# EAGLE board Hutschienenmoped-XL_2ETH (EAGLE 9.6.2)
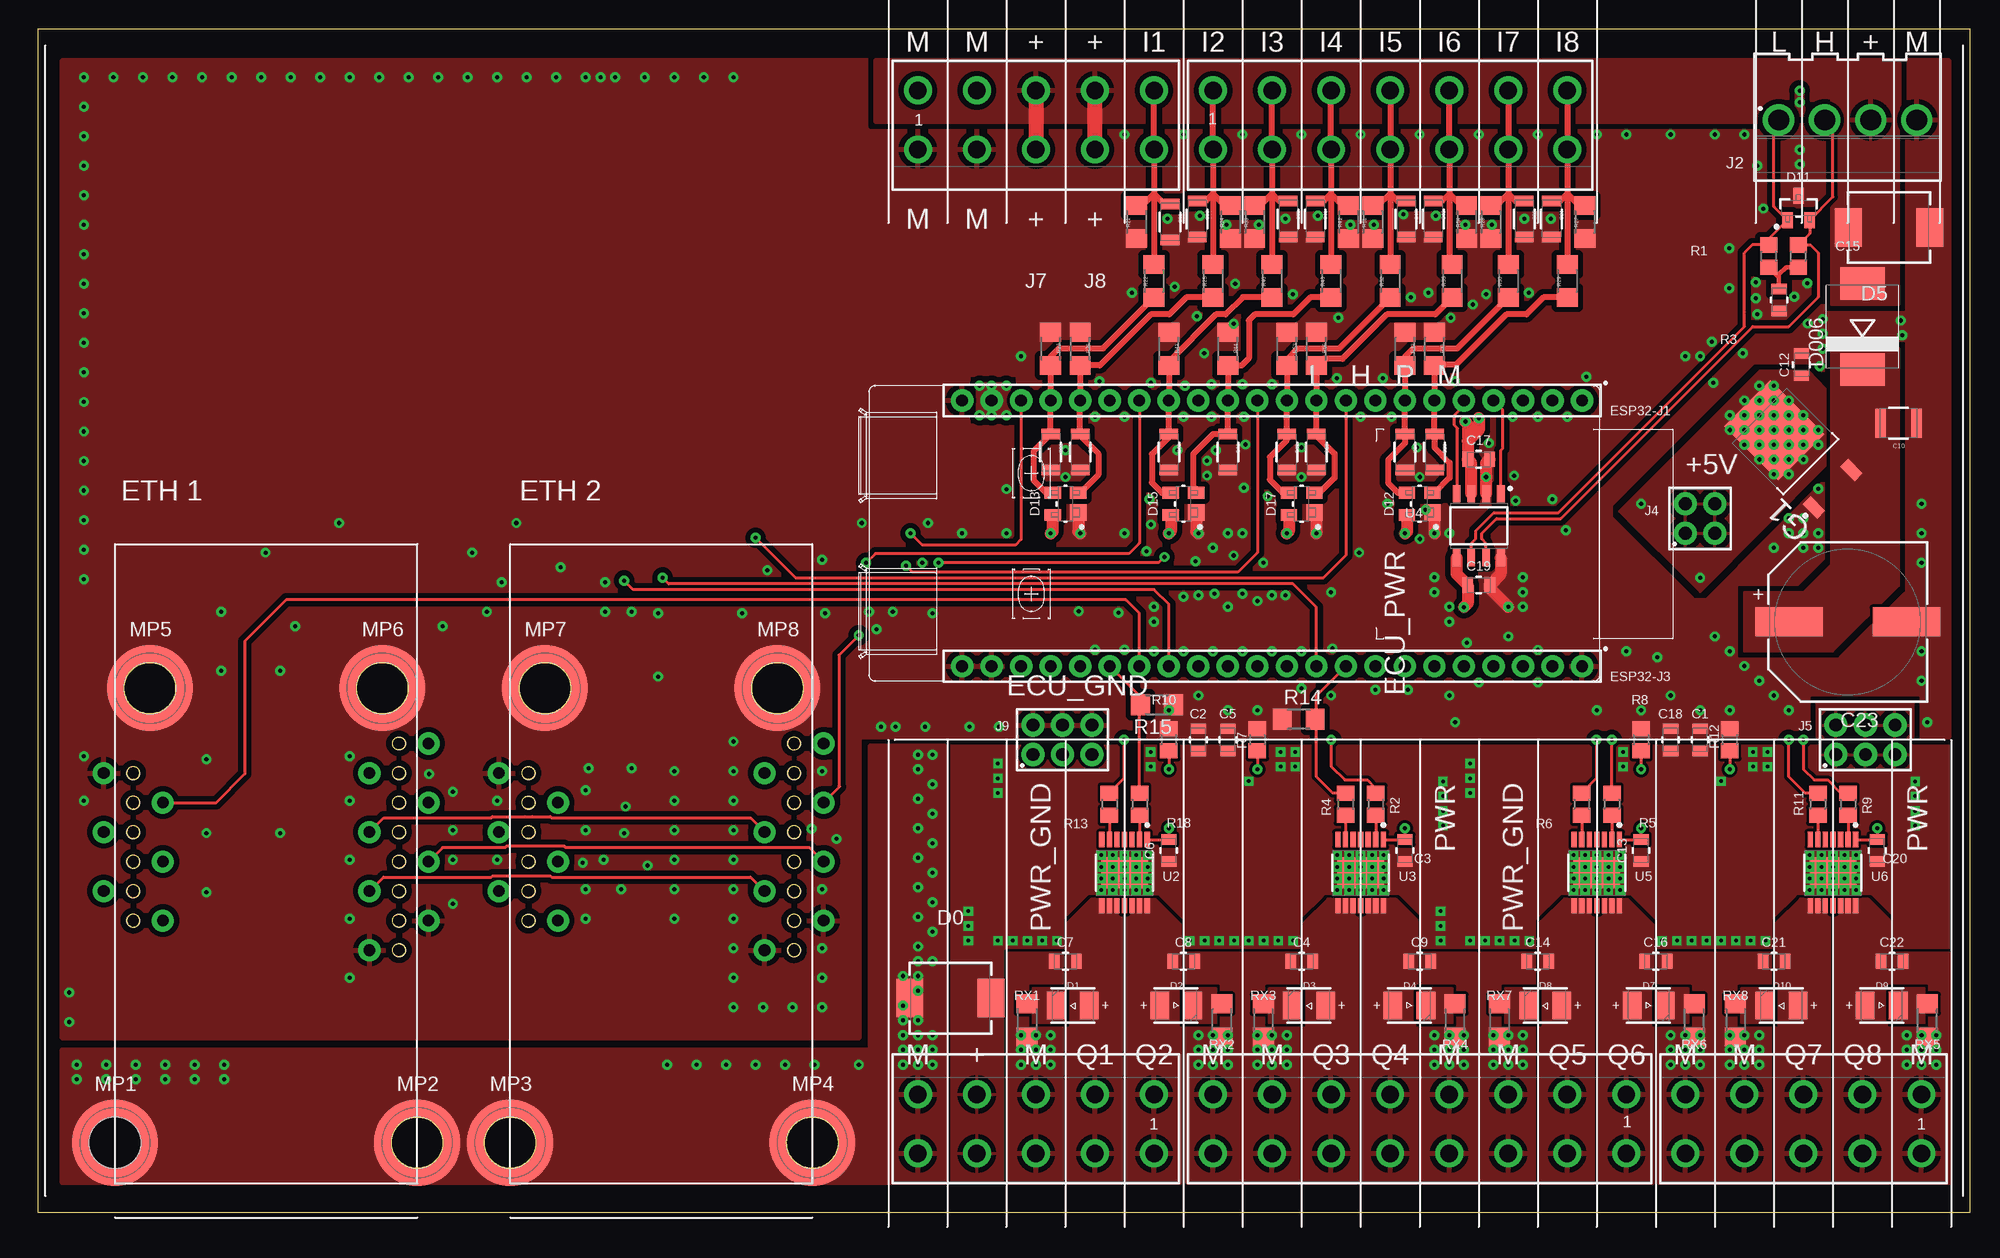
[diagram p13: board, top side]
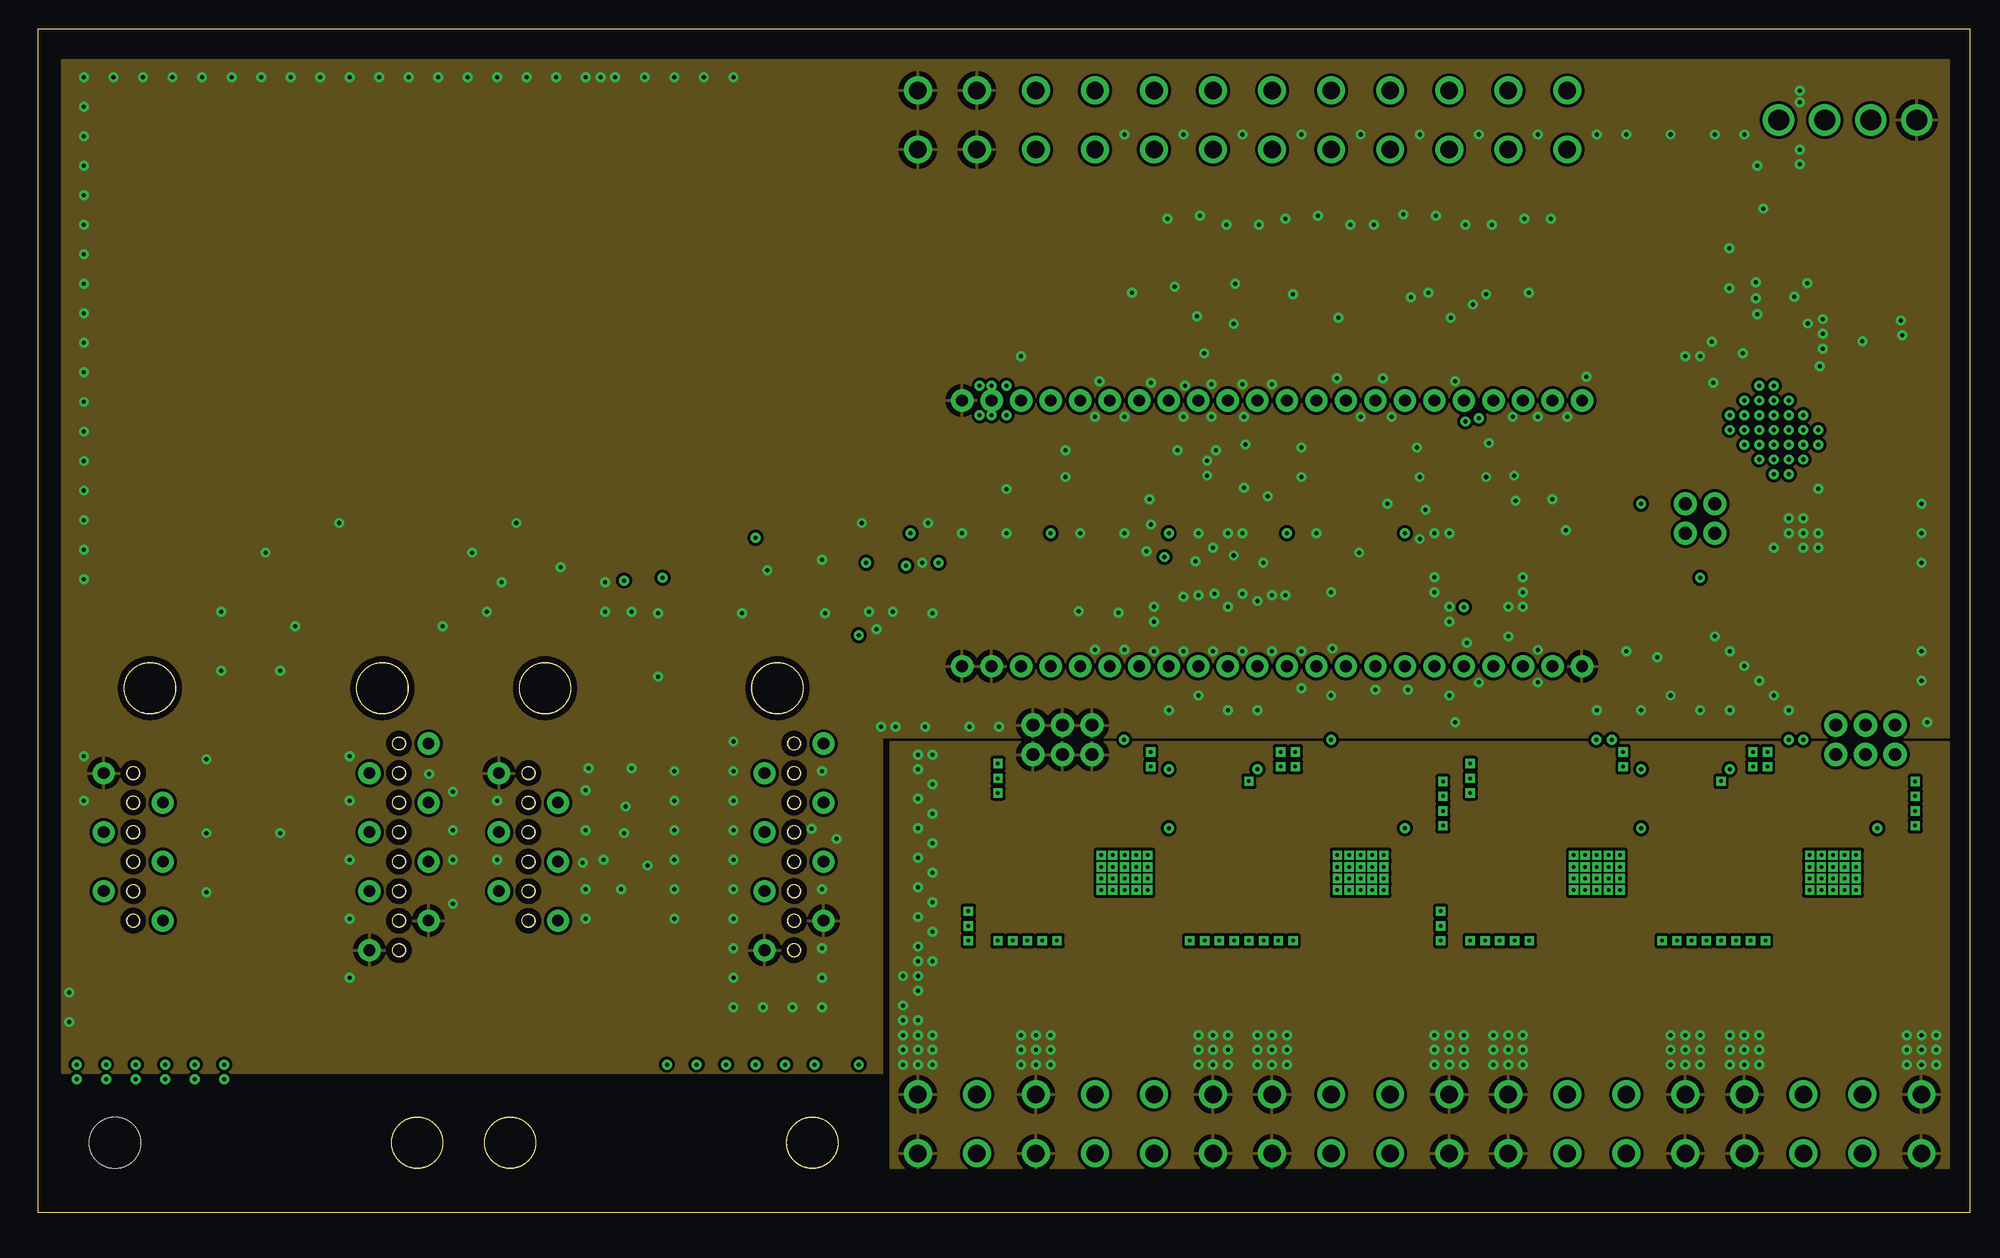
[diagram p14: board, inner layer Route2]
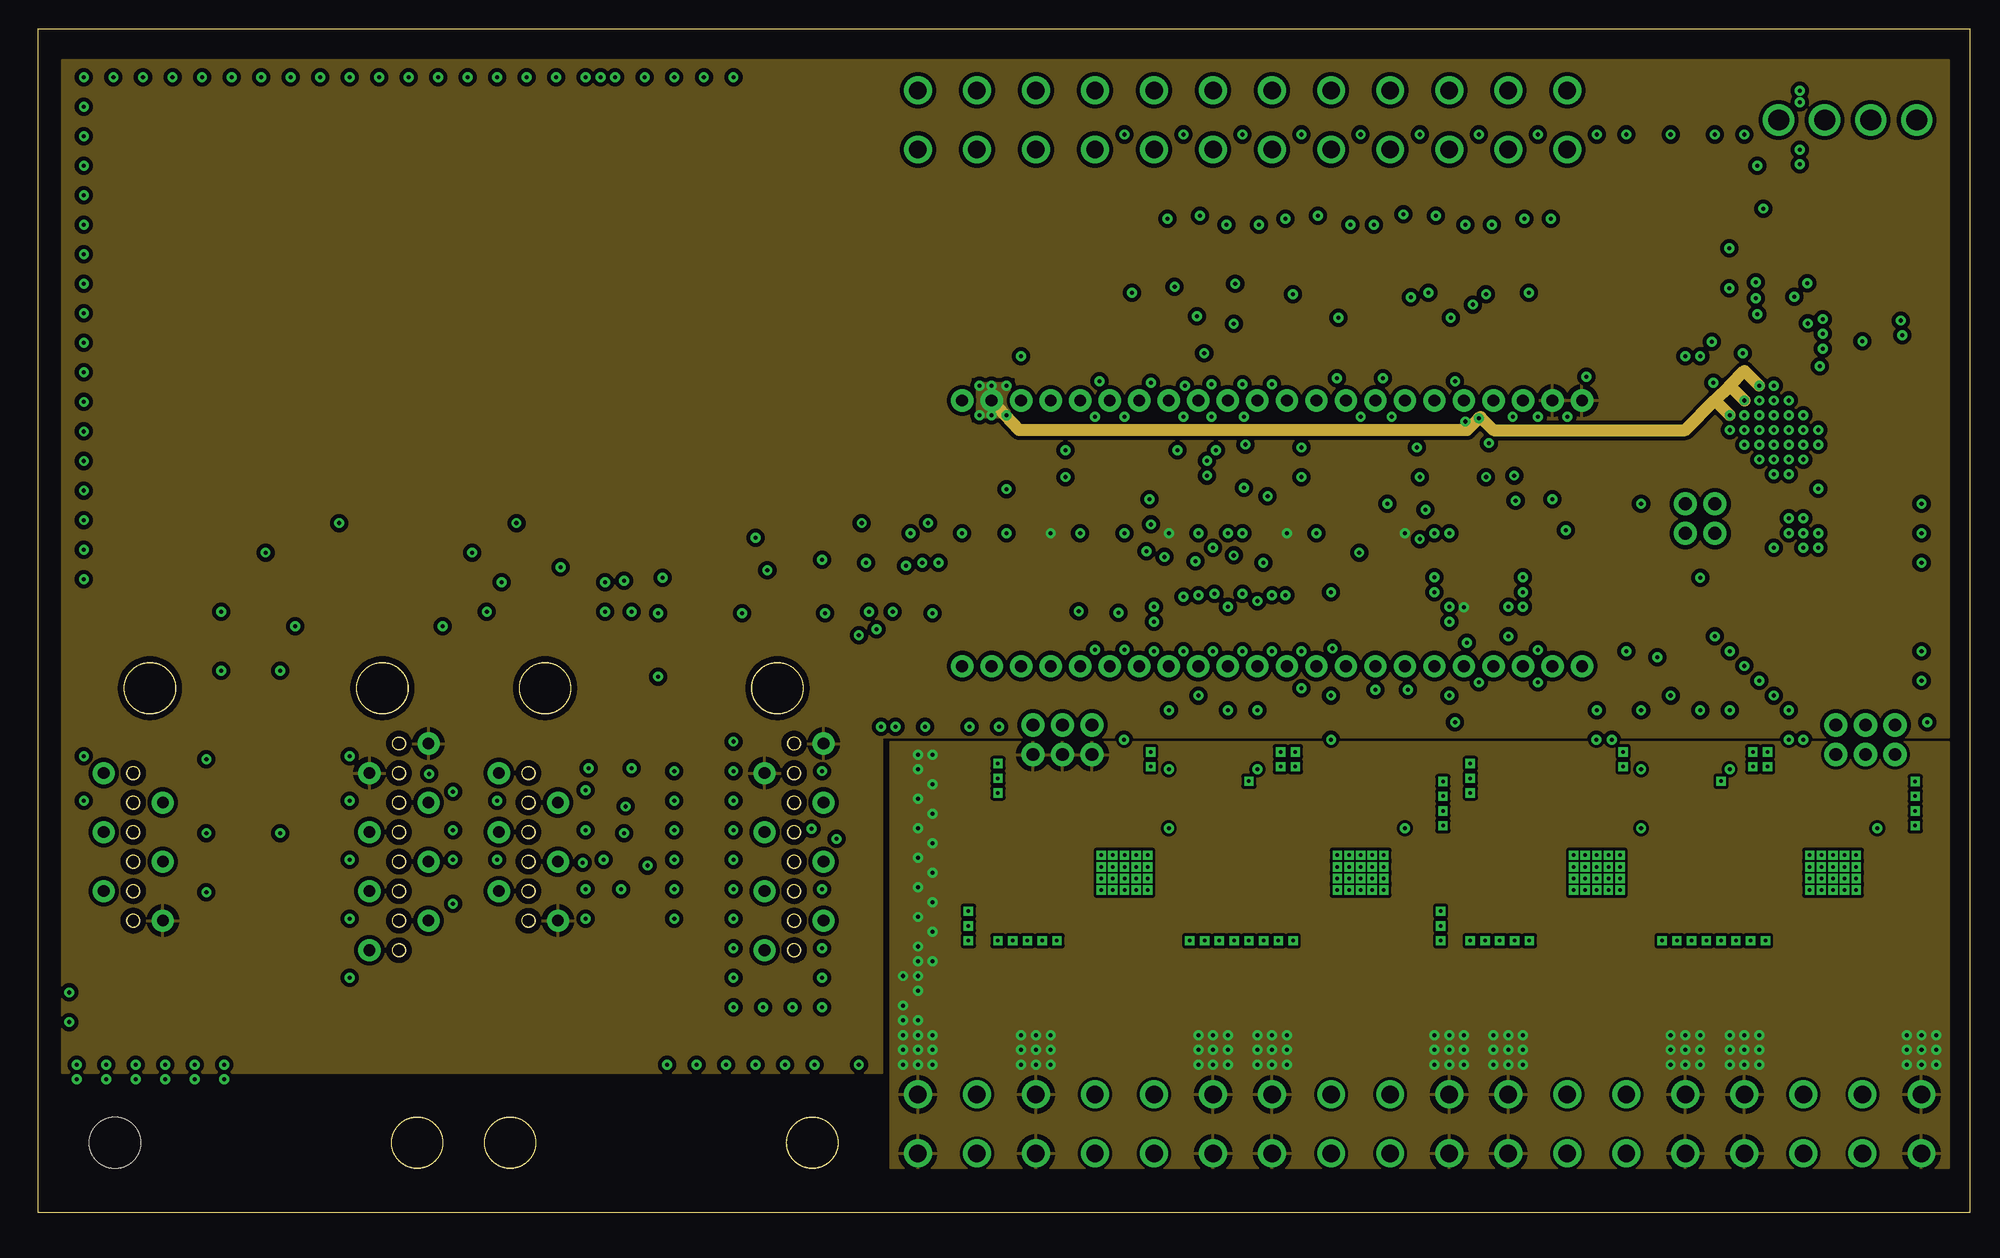
[diagram p15: board, inner layer Route15]
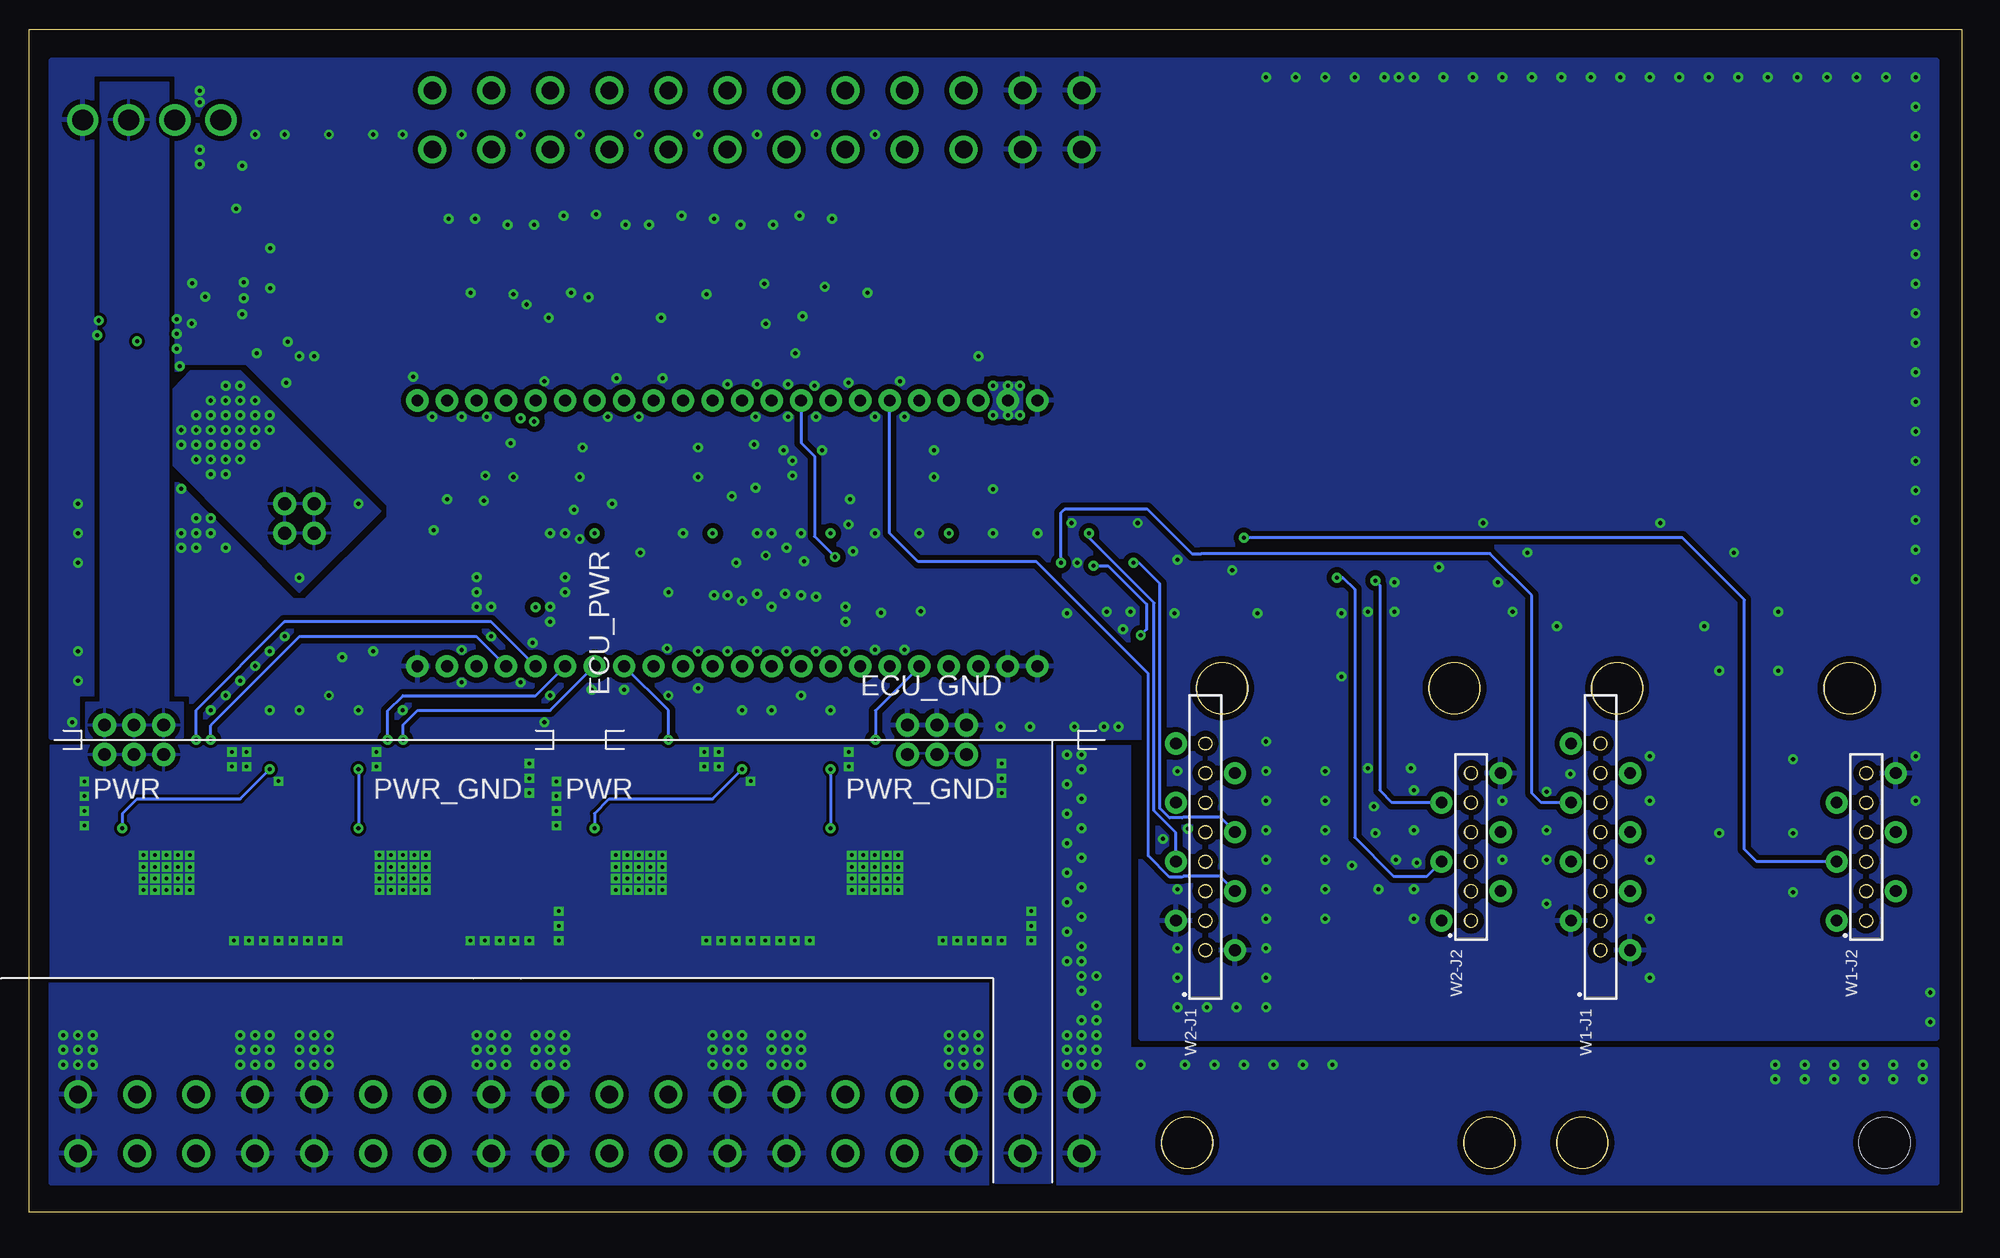
[diagram p16: board, bottom side, seen from below]

Size 166.3 x 101.8 mm. Coordinates in mm from the lower left corner, seen from the top.
Outline: 1614 segments
Copper layers (1+2*15+16): Top 0.07mm / dielectric 0.36mm / Route2 0.035mm / dielectric 0.71mm / Route15 0.035mm / dielectric 0.2mm / Bottom 0.07mm
Design rules "Multi-CB_4L_250µm-Tracks_OL105µm-IL35µm *": minimum track width 0.25mm, minimum drill 0.2mm, track to track 0.25mm, track to pad 0.25mm, pad to pad 0.2mm, via to via 0.25mm, smd to smd 0mil, copper to edge 0.5mm, drill to drill 0.5mm, minimum pad ring 0.45mm, minimum via ring 0.25mm, stop-mask expansion 2mil, vias tented up to drill 0.45mm, thermal gap 0.45mm
Net classes: 1 GND: width 0.127 mm, clearance 0.127 mm to class 0
tKeepout: area 121.9,39.9 to 122.7,41.5; area 74.5,39.9 to 75.3,41.5; area 162.5,39.9 to 163.3,41.5; area 115.1,39.9 to 115.9,41.5
bKeepout: area 74.5,39.9 to 76,41.5; area 121.2,39.9 to 122.7,41.5; area 115.1,39.9 to 116.6,41.5; area 161.8,39.9 to 163.3,41.5

## Footprints (pad centres in the part's own frame; a part is rotated, then mirrored left to right if it is on the bottom)
WCAP-CSGP_0805_H0.8_R = smd 0.9 x 1.3: 1 -0.95,0; 2 0.95,0
WCAP-CSGP_1210_H2.5 = smd 0.9 x 2.5: 1 -1.55,0; 2 1.55,0
WCAP-CSGP_0805_H1.25_R = smd 0.9 x 1.3: 1 -0.95,0; 2 0.95,0
WCAP-ASLI_12.5X14(DXL) = smd 5.8 x 2.5: 1 5.05,0; 2 -5.05,0
WCAP-CSGP_1206_H0.8 = smd 0.9 x 1.6: 1 -1.55,0; 2 1.55,0
WE-TVSP_DO-214AB_BIDIRECTIONAL = smd 2.3 x 3.3: 1 -3.5,0; 2 3.5,0
WL-SMTW_3528 = smd 1.6 x 2.4: 1 -1.425,0; 2 1.425,0
SMC = smd 2.8 x 3.8: A 3.7,0; C -3.7,0
WE-TVS_SOT23-3L = smd 0.9 x 1.4: 1 -0.95,-1.05; 2 0.95,-1.05; 3 0,1.05
WE-TVS_SOT143-4L = smd 1.4 x 1.4: 1 -0.75,-1.1 | smd 1 x 1.4: 2 0.95,-1.1; 3 0.95,1.1; 4 -0.95,1.1
61302211821 = drill 1.02: 1 -26.67,0; 2 -24.13,0; 3 -21.59,0; 4 -19.05,0; 5 -16.51,0; 6 -13.97,0; 7 -11.43,0; 8 -8.89,0; 9 -6.35,0; 10 -3.81,0; 11 -1.27,0; 12 1.27,0; 13 3.81,0; 14 6.35,0; 15 8.89,0; 16 11.43,0; 17 13.97,0; 18 16.51,0; 19 19.05,0; 20 21.59,0; 21 24.13,0; 22 26.67,0
INF-PG-TO252-3-11_N = smd 1.75 x 0.95: 1 -3.55,2.28; 3 -3.55,-2.28 | smd 6.6 x 5.6: 2 3.55,0
638207222005 = drill 1.5: 1 -10.16,2.54; 2 -5.08,2.54; 3 0,2.54; 4 5.08,2.54; 5 10.16,2.54; A1 -10.16,-2.54; A2 -5.08,-2.54; A3 0,-2.54; A4 5.08,-2.54; A5 10.16,-2.54
645004114822 = drill 1.8: 1 5.94,0.5; 2 1.98,0.5; 3 -1.98,0.5; 4 -5.94,0.5
61300421121 = drill 1.1: 1 -1.27,-1.27; 2 -1.27,1.27; 3 1.27,-1.27; 4 1.27,1.27
61300621121 = drill 1.1: 1 -2.54,-1.27; 2 -2.54,1.27; 3 0,-1.27; 4 0,1.27; 5 2.54,-1.27; 6 2.54,1.27
638207222007 = drill 1.5: 1 -15.24,2.54; 2 -10.16,2.54; 3 -5.08,2.54; 4 0,2.54; 5 5.08,2.54; 6 10.16,2.54; 7 15.24,2.54; A1 -15.24,-2.54; A2 -10.16,-2.54; A3 -5.08,-2.54; A4 0,-2.54; A5 5.08,-2.54; A6 10.16,-2.54; A7 15.24,-2.54
638207222008 = drill 1.5: 1 -17.78,2.54; 2 -12.7,2.54; 3 -7.62,2.54; 4 -2.54,2.54; 5 2.54,2.54; 6 7.62,2.54; 7 12.7,2.54; 8 17.78,2.54; A1 -17.78,-2.54; A2 -12.7,-2.54; A3 -7.62,-2.54; A4 -2.54,-2.54; A5 2.54,-2.54; A6 7.62,-2.54; A7 12.7,-2.54; A8 17.78,-2.54
WA-SMSI_9774025360 = smd 7.4 x 7.4: 1 0,0 | hole 4.4: 0,0
R0805 = smd 1.3 x 1.5: 1 -0.95,0; 2 0.95,0
R1206 = smd 1.6 x 1.803: 1 -1.422,0; 2 1.422,0
SOP65P600X115-15N-V = smd 1.31 x 0.45: 1 -2.85,1.95; 2 -2.85,1.3; 3 -2.85,0.65; 4 -2.85,0; 5 -2.85,-0.65; 6 -2.85,-1.3; 7 -2.85,-1.95; 8 2.85,-1.95; 9 2.85,-1.3; 10 2.85,-0.65; 11 2.85,0; 12 2.85,0.65; 13 2.85,1.3; 14 2.85,1.95 | smd 2.65 x 4: 15 0,0
SOIC127P602X173-8N-V = smd 1.47 x 0.65: 1 -2.765,1.905; 2 -2.765,0.635; 3 -2.765,-0.635; 4 -2.765,-1.905; 5 2.765,-1.905; 6 2.765,-0.635; 7 2.765,0.635; 8 2.765,1.905
61301015721 = drill 1: 1 -8.89,-2.54; 2 -6.35,2.54; 3 -3.81,-2.54; 4 -1.27,2.54; 5 1.27,-2.54; 6 3.81,2.54; 7 6.35,-2.54; 8 8.89,2.54 | hole 1.1: -8.89,0; -6.35,0; -3.81,0; -1.27,0; 1.27,0; 3.81,0; 6.35,0; 8.89,0
61300615721 = drill 1: 1 -6.35,2.54; 2 -3.81,-2.54; 3 -1.27,2.54; 4 1.27,-2.54; 5 3.81,2.54; 6 6.35,-2.54 | hole 1.1: -6.35,0; -3.81,0; -1.27,0; 1.27,0; 3.81,0; 6.35,0

## Placement (x,y rotation side)
C1  100nF  [WCAP-CSGP_0805_H0.8_R]  143.04,40.66 90 top
C2  100nF  [WCAP-CSGP_0805_H0.8_R]  99.86,40.66 90 top
C3  100nF  [WCAP-CSGP_0805_H0.8_R]  117.64,31.14 90 top
C4  10nF  [WCAP-CSGP_0805_H0.8_R]  108.75,21.61 0 top
C5  100nF  [WCAP-CSGP_0805_H0.8_R]  102.4,40.66 90 top
C6  100nF  [WCAP-CSGP_0805_H0.8_R]  97.32,31.14 90 top
C7  10nF  [WCAP-CSGP_0805_H0.8_R]  88.43,21.61 0 top
C8  10nF  [WCAP-CSGP_0805_H0.8_R]  98.59,21.61 0 top
C9  10nF  [WCAP-CSGP_0805_H0.8_R]  118.91,21.61 0 top
C10  22uF  [WCAP-CSGP_1210_H2.5]  160.12,67.89 180 top
C12  22uF  [WCAP-CSGP_0805_H1.25_R]  151.76,72.93 270 top
C13  100nF  [WCAP-CSGP_0805_H0.8_R]  137.96,31.14 90 top
C14  10nF  [WCAP-CSGP_0805_H0.8_R]  129.07,21.61 0 top
C15  47nF  [WCAP-CSGP_0805_H0.8_R]  149.83,78.51 270 top
C16  10nF  [WCAP-CSGP_0805_H0.8_R]  139.23,21.61 0 top
C17  100nF  [WCAP-CSGP_0805_H0.8_R]  123.99,64.79 0 top
C18  100nF  [WCAP-CSGP_0805_H0.8_R]  140.5,40.66 90 top
C19  100nF  [WCAP-CSGP_0805_H0.8_R]  123.99,53.98 0 top
C20  100nF  [WCAP-CSGP_0805_H0.8_R]  158.28,31.14 90 top
C21  10nF  [WCAP-CSGP_0805_H0.8_R]  149.39,21.61 0 top
C22  10nF  [WCAP-CSGP_0805_H0.8_R]  159.55,21.61 0 top
C23  330 µF  [WCAP-ASLI_12.5X14(DXL)]  155.74,50.8 180 top
C24  100nF  [WCAP-CSGP_1206_H0.8]  130.24,85.47 270 top
C25  100nF  [WCAP-CSGP_1206_H0.8]  127.9,85.47 270 top
C26  100nF  [WCAP-CSGP_1206_H0.8]  120.18,65.41 270 top
C27  100nF  [WCAP-CSGP_1206_H0.8]  117.64,65.41 270 top
C31  100nF  [WCAP-CSGP_1206_H0.8]  97.42,85.22 270 top
C32  100nF  [WCAP-CSGP_1206_H0.8]  87.16,65.41 270 top
C33  100nF  [WCAP-CSGP_1206_H0.8]  99.76,85.47 270 top
C34  100nF  [WCAP-CSGP_1206_H0.8]  89.7,65.41 270 top
C39  100nF  [WCAP-CSGP_1206_H0.8]  107.58,85.47 270 top
C40  100nF  [WCAP-CSGP_1206_H0.8]  97.32,65.41 270 top
C41  100nF  [WCAP-CSGP_1206_H0.8]  109.92,85.47 270 top
C42  100nF  [WCAP-CSGP_1206_H0.8]  102.4,65.41 270 top
C47  100nF  [WCAP-CSGP_1206_H0.8]  117.74,85.47 270 top
C48  100nF  [WCAP-CSGP_1206_H0.8]  107.48,65.41 270 top
C49  100nF  [WCAP-CSGP_1206_H0.8]  120.08,85.47 270 top
C50  100nF  [WCAP-CSGP_1206_H0.8]  110.02,65.41 270 top
D0  33V  [WE-TVSP_DO-214AB_BIDIRECTIONAL]  78.52,18.43 0 top
D1  150141VS73100  [WL-SMTW_3528]  89.06,17.8 0 top
D2  150141VS73100  [WL-SMTW_3528]  97.96,17.8 180 top
D3  150141VS73100  [WL-SMTW_3528]  109.39,17.8 0 top
D4  150141VS73100  [WL-SMTW_3528]  118.02,17.8 180 top
D5  33V  [WE-TVSP_DO-214AB_BIDIRECTIONAL]  159.3,84.73 180 top
D006  MBRS340T3  [SMC]  157.01,76.2 90 top
D7  150141VS73100  [WL-SMTW_3528]  138.59,17.8 180 top
D8  150141VS73100  [WL-SMTW_3528]  129.71,17.8 0 top
D9  150141VS73100  [WL-SMTW_3528]  158.66,17.8 180 top
D10  150141VS73100  [WL-SMTW_3528]  150.03,17.8 0 top
D11  24Vdc  [WE-TVS_SOT23-3L]  151.51,86.41 0 top
D12  3.3Vdc  [WE-TVS_SOT143-4L]  118.91,60.96 90 top
D13  3.3Vdc  [WE-TVS_SOT143-4L]  88.43,60.96 90 top
D15  3.3Vdc  [WE-TVS_SOT143-4L]  98.59,60.96 90 top
D17  3.3Vdc  [WE-TVS_SOT143-4L]  108.75,60.96 90 top
ESP32-J1  61302211821  [61302211821]  106.21,69.85 180 top
ESP32-J3  61302211821  [61302211821]  106.21,46.99 180 top
G1  [INF-PG-TO252-3-11_N]  151.93,64.77 135 top
J1  638207222005  [638207222005]  151.93,7.62 180 top
J2  645004114822  [645004114822]  155.74,94.48 180 top
J4  61300421121  [61300421121]  143.04,59.69 0 top
J5  [61300621121]  157.26,40.66 0 top
J7  638207222005  [638207222005]  85.89,93.98 0 top
J8  638207222007  [638207222007]  116.37,93.98 0 top
J9  [61300621121]  88.18,40.66 0 top
J13  638207222005  [638207222005]  85.89,7.62 180 top
J15  638207222008  [638207222008]  118.91,7.62 180 top
MP1  M3 x 2.5mm  [WA-SMSI_9774025360]  6.65,6 0 top
MP2  M3 x 2.5mm  [WA-SMSI_9774025360]  32.65,6 0 top
MP3  M3 x 2.5mm  [WA-SMSI_9774025360]  40.65,6 0 top
MP4  M3 x 2.5mm  [WA-SMSI_9774025360]  66.65,6 0 top
MP5  M3 x 2.5mm  [WA-SMSI_9774025360]  9.65,45.1 0 top
MP6  M3 x 2.5mm  [WA-SMSI_9774025360]  29.65,45.1 0 top
MP7  M3 x 2.5mm  [WA-SMSI_9774025360]  43.65,45.1 0 top
MP8  M3 x 2.5mm  [WA-SMSI_9774025360]  63.65,45.1 0 top
R1  60R  [R0805]  151.49,82.28 90 top
R2  4k7  [R0805]  115.13,35.12 270 top
R3  60R  [R0805]  148.95,82.28 90 top
R4  4k7  [R0805]  112.53,35.12 270 top
R5  4k7  [R0805]  135.45,35.12 270 top
R6  4k7  [R0805]  132.85,35.12 270 top
R7  47R  [R0805]  104.94,40.66 270 top
R8  47R  [R0805]  137.96,40.66 270 top
R9  4k7  [R0805]  155.77,35.12 270 top
R10  47R  [R0805]  97.32,40.66 270 top
R11  4k7  [R0805]  153.17,35.12 270 top
R12  47R  [R0805]  145.58,40.66 270 top
R13  4k7  [R0805]  92.21,35.12 270 top
R14  13K  [R1206]  108.5,42.42 0 top
R15  13K  [R1206]  96.3,43.69 180 top
R18  4k7  [R0805]  94.81,35.12 270 top
R21  1K2  [R1206]  94.55,85.22 90 top
R22  47K  [R1206]  96.05,80.14 90 top
R23  13K  [R1206]  87.16,74.3 270 top
R24  1K2  [R1206]  102.63,85.22 90 top
R25  47K  [R1206]  101.13,80.14 90 top
R26  13K  [R1206]  89.7,74.3 270 top
R27  1K2  [R1206]  133.11,85.22 90 top
R28  1K2  [R1206]  125.03,85.22 90 top
R29  47K  [R1206]  131.61,80.14 90 top
R30  47K  [R1206]  126.53,80.14 90 top
R31  13K  [R1206]  120.18,74.3 270 top
R32  13K  [R1206]  117.64,74.3 270 top
R39  1K2  [R1206]  104.71,85.22 90 top
R40  47K  [R1206]  106.21,80.14 90 top
R41  13K  [R1206]  97.32,74.3 270 top
R42  1K2  [R1206]  112.79,85.22 90 top
R43  47K  [R1206]  111.29,80.14 90 top
R44  13K  [R1206]  102.4,74.3 270 top
R51  1K2  [R1206]  114.87,85.22 90 top
R52  47K  [R1206]  116.37,80.14 90 top
R53  13K  [R1206]  107.48,74.3 270 top
R54  1K2  [R1206]  122.95,85.22 90 top
R55  47K  [R1206]  121.7,80.14 90 top
R56  13K  [R1206]  110.02,74.3 270 top
RX1  470Ohm  [R1206]  85.13,16.53 90 top
RX2  470Ohm  [R1206]  101.89,16.53 270 top
RX3  470Ohm  [R1206]  105.45,16.53 90 top
RX4  470Ohm  [R1206]  121.96,16.53 270 top
RX5  470Ohm  [R1206]  162.6,16.53 270 top
RX6  470Ohm  [R1206]  142.53,16.53 270 top
RX7  470Ohm  [R1206]  125.77,16.53 90 top
RX8  470Ohm  [R1206]  146.09,16.53 90 top
U2  [SOP65P600X115-15N-V]  93.51,29.23 270 top
U3  [SOP65P600X115-15N-V]  113.83,29.23 270 top
U4  TLE9250VSJ  [SOIC127P602X173-8N-V]  123.99,59.08 270 top
U5  [SOP65P600X115-15N-V]  134.15,29.23 270 top
U6  [SOP65P600X115-15N-V]  154.47,29.23 270 top
W1-J1  61301015721  [61301015721]  31.08,31.45 90 bottom
W1-J2  61300615721  [61300615721]  8.22,31.45 90 bottom
W2-J1  61301015721  [61301015721]  65.08,31.45 90 bottom
W2-J2  61300615721  [61300615721]  42.22,31.45 90 bottom

## Tracks (layer width: path | path; a pad name or v marks a point on that pad's centre or on a via)
+3V3  (via drill 0.35)
  Top 1.016: D13.4 87.33,58.59 v87.16,58.42 | D15.4 97.49,58.59 v97.32,58.42 | D17.4 107.65,58.59 v107.48,58.42 | D12.4 117.81,58.59 v117.64,58.42 | U4.5 122.09,54.93 C19.1 123.04,52.39 v122.72,52.07
  pour Route15 (isolate 0.35, rank 2): 2.12,12 2.12,99.1 164.43,99.1 164.43,40.86 72.65,40.86 72.65,12
+5V  (via drill 0.35)
  Top 1.016: U4.3 123.36,64.47 C17.1 123.04,66.36 | v123.99,68.33 123.99,67.31 123.04,66.36 | v122.83,68.04 123.04,67.72 123.04,66.36
  Route15 1.016: ESP32-J1.21 84.46,67.31 122.97,67.31 v123.99,68.33 124.15,68.42 125.26,67.31 141.77,67.31 144.31,69.85 | v148.12,71.12 146.85,72.39 145.58,71.12 | 144.31,69.85 145.58,71.12 | v146.85,69.85 145.58,71.12 | v145.58,68.58 144.31,69.85
  other vias: 143.04,54.61 149.39,69.85 148.12,69.85 146.85,68.58 146.85,67.31 148.12,68.58 148.12,67.31 149.39,67.31 149.39,68.58 150.66,68.58 150.66,67.31 151.93,67.31 151.93,66.04 150.66,66.04 150.66,64.77 149.39,64.77 149.39,66.04 148.12,66.04 150.66,69.85 151.93,68.58 153.2,67.31 153.2,66.04 150.66,63.5 149.39,63.5 148.12,64.77 146.85,66.04 145.58,67.31 149.39,71.12 151.93,64.77 137.96,60.96 83.35,71.12 81.05,71.12 81.05,68.58 83.35,68.58 82.08,71.12 82.08,68.58
  pour Top: 153.84,70.86 152.4,72.39 148.12,72.39 136.06,60.33 143.04,53.34 153.84,64.23
  pour Route15 (isolate 0.254, no thermals): 80.81,71.39 83.6,71.39 83.6,68.35 80.81,68.35
  pour Top (isolate 0.254, no thermals): 80.81,71.39 83.6,71.39 83.6,68.35 80.81,68.35
  pour Bottom (isolate 0.254, no thermals): 80.81,71.39 83.6,71.39 83.6,68.35 80.81,68.35
  pour Bottom: 153.84,70.86 152.4,72.39 148.12,72.39 136.06,60.33 143.04,53.34 153.84,64.23
+6V
  pour Top (isolate 0.254, no thermals): 139.23,19.32 142.02,19.32 142.02,16.28 139.23,16.28
AGNDU2  (via drill 0.35)
  Top 0.254: U2.1 C6.2 v97.32,33.04 | R10.2 v97.32,38.12
  Bottom 0.254: v97.32,38.12 v97.32,33.04
AGNDU3  (via drill 0.35)
  Top 0.254: U3.1 C3.2 v117.64,33.04 | R7.2 v104.94,38.12
  Bottom 0.254: v104.94,38.12 107.48,35.58 116.37,35.58 117.64,34.31 v117.64,33.04
AGNDU4  (via drill 0.35)
  Top 0.254: U5.1 C13.2 v137.96,33.04 | R8.2 v137.96,38.12
  Bottom 0.254: v137.96,38.12 v137.96,33.04
AGNDU5  (via drill 0.35)
  Top 0.254: U6.1 C20.2 v158.28,33.04 | R12.2 v145.58,38.12
  Bottom 0.254: v145.58,38.12 148.12,35.58 157.01,35.58 158.28,34.31 v158.28,33.04
CAN1_RXD
  Top 0.254: ESP32-J1.5 122.72,69.39 121.89,68.56 121.89,67.72 122.16,67.46 122.16,61.91 U4.4
CAN1_TXD
  Top 0.254: U4.1 125.9,65.56 126.06,65.73 126.06,69.05 ESP32-J1.4
CAN_N
  Top 0.254: U4.6 123.36,57.55 123.74,57.94 123.74,58.63 125.3,60.19 130.84,60.19 146.85,76.2 146.85,77.47 | J2.1 149.39,93.57 149.39,86.52 D11.1 148.95,83.75 R3.2 147.53,83.23 146.85,82.55 146.85,77.47 | 146.85,77.47
CAN_P
  Top 0.254: U4.7 124.62,57.55 124.24,57.94 124.24,58.42 125.51,59.69 131.05,59.69 147.56,76.2 150.66,76.2 153.2,78.74 153.2,82.55 152.52,83.23 R1.2 152.46,84.2 D11.2 154.47,87.37 154.47,93.27 J2.2
CI1
  Top 0.508: D13.3 86.77,61.91 85.7,62.98 85.7,65.49 C32.1 ESP32-J1.19 R23.2 87.16,73.62 87.87,74.33 91.67,74.33 R22.1
CI2
  Top 0.508: R25.1 98.83,78.72 97.37,77.25 95.78,77.25 91.4,72.87 R26.2 ESP32-J1.18 C34.1 89.7,66.83 91.26,65.28 91.26,63.45 89.72,61.91 D13.2
CI3
  Top 0.508: D15.3 96.73,61.91 95.86,62.78 95.86,65.23 97.32,66.7 C40.1 ESP32-J1.15 R41.2 97.32,73.19 101.39,77.25 102.2,77.25 103.69,78.74 106.19,78.74 R40.1
CI4
  Top 0.508: D15.2 99.69,62.2 99.42,62.48 99.42,65.23 101.14,66.95 C42.1 ESP32-J1.13 R44.2 103.61,72.87 104.22,73.48 104.22,76.75 104.73,77.25 108.04,77.25 109.5,78.72 R43.1
CI5
  Top 0.508: D17.3 107.14,61.91 106.02,63.03 106.02,64.98 107.48,66.44 C48.1 ESP32-J1.11 R53.2 107.48,73.37 108.44,74.33 111.99,74.33 R52.1
CI6
  Top 0.508: R55.1 120.24,77.25 116.1,77.25 112.26,73.42 110.57,73.42 R56.2 ESP32-J1.10 C50.1 110.02,66.83 111.58,65.28 111.58,63.2 110.29,61.91 D17.2
CI7
  Top 0.508: D12.3 117.05,61.91 116.18,62.78 116.18,64.73 117.64,66.19 C27.1 ESP32-J1.7 R32.2 117.64,73.62 118.35,74.33 122.15,74.33 R30.1
CI8
  Top 0.508: R29.1 129.57,78.72 128.11,77.25 126.39,77.25 122.04,72.91 120.22,72.91 R31.2 ESP32-J1.6 C26.1 120.18,65.82 121.48,64.51 121.48,63.2 120.2,61.91 D12.2
CS0  (via drill 0.35)
  Top 0.25: v96.94,56.39 96.45,55.9 77.51,55.9 v77.51,55.88
  Bottom 0.25: W1-J1.6 36.19,35.26 37,36.07 37,53.09 40.59,56.68 65.44,56.68 65.44,56.64 66.22,56.64 70.07,60.49 77.2,60.49 77.51,60.19 v77.51,55.88 | ESP32-J1.14 99.86,66.2 98.72,65.06 98.72,58.17 v96.94,56.39
CS1  (via drill 0.35)
  Top 0.25: ESP32-J1.12 104.94,56.77 103.25,55.08 75.26,55.08 v74.71,55.63 | W2-J1.6 69,36.64 68.95,36.69 68.95,47.95 v70.65,49.66
  Bottom 0.25: v74.71,55.63 73.44,55.63 70.14,52.32 70.14,50.16 v70.65,49.66
ECU_GND  (via drill 0.35)
  Top 1.016: D13.1 89.53,58.59 v89.7,58.42 | D15.1 99.69,58.59 v99.86,58.42 | D17.1 110.02,60.04 v110.02,58.42 | D12.1 120.18,60.04 v120.18,58.42 | U4.8 125.9,54.93 C19.2 124.94,53.68 v126.53,52.09 | C17.2 124.62,64.47 U4.2
  other vias: 143.04,73.64 141.77,73.64 144.06,74.91 118.91,57.93 121.45,58.44 120.18,53.36 121.45,52.09 121.45,50.82 121.96,42.18 153.58,74.31 104.94,43.2 102.4,43.2 99.86,44.47 97.32,43.2 139.36,47.77 136.69,48.28 127.8,53.36 127.8,54.63 120.18,54.63 162.09,60.98 162.09,58.44 157.01,74.95 162.09,55.9 162.09,48.28 162.09,45.74 162.6,42.18 145.58,43.2 143.04,43.2 140.5,44.47 137.96,43.2 127.8,52.09 108.75,63.27 98.08,65.55 88.43,65.55 118.66,65.81 124.88,66.19 147.83,80.01 151.13,78.78 151.61,91.43 151.61,90.16 151.61,95.49 151.61,96.51 153.58,75.58 153.58,76.86 152.31,76.47 150.66,58.44 149.39,57.17 151.93,57.17 153.2,57.17 153.2,62.25 150.66,59.71 153.2,58.44 151.93,58.44 151.93,59.71 98.59,92.73 103.67,92.73 108.75,92.73 113.83,92.73 118.91,92.73 123.99,92.73 129.07,92.73 134.15,92.73 93.51,92.73 145.58,48.28 146.85,47.01 148.12,45.74 149.39,44.47 121.45,44.47 134.15,43.2 111.29,44.47 126.53,49.55 144.31,49.55 150.66,43.2 97.19,85.47 99.99,85.72 102.27,84.96 105.07,84.96 107.35,85.47 110.15,85.72 112.94,84.96 114.97,84.96 117.51,85.85 120.31,85.72 127.93,85.47 130.21,85.47 128.31,79.12 118.15,78.74 119.67,79.12 107.99,78.99 103.03,79.88 97.83,79.63 94.15,79.12 99.73,77.09 91.35,71.5 95.8,71.37 122.85,84.96 125.13,84.96 123.48,78.11 124.62,78.99 3.98,97.66 3.98,95.12 3.98,92.58 3.98,90.04 3.98,87.5 3.98,84.96 3.98,82.42 3.98,79.88 3.98,77.34 3.98,74.8 3.98,72.26 3.98,69.72 3.98,67.18 3.98,64.64 3.98,62.1 3.98,59.56 3.98,57.02 3.98,54.48 6.52,97.66 9.06,97.66 11.6,97.66 14.14,97.66 16.68,97.66 19.22,97.66 21.76,97.66 24.3,97.66 26.84,97.66 29.38,97.66 31.92,97.66 34.46,97.66 37,97.66 39.54,97.66 42.08,97.66 44.62,97.66 48.43,97.66 47.16,97.66 49.7,97.66 52.24,97.66 54.78,97.66 57.32,97.66 59.86,97.66 111.29,53.36 107.35,53.11 106.21,53.11 104.94,52.6 103.67,53.23 102.4,52.09 101.26,53.23 99.86,53.11 98.59,52.98 98.59,48.28 101.13,48.28 103.67,48.28 106.21,48.28 108.75,48.28 96.05,48.28 96.05,52.09 96.05,50.82 101.13,57.17 103.67,58.44 102.4,58.44 93.51,58.42 83.35,58.42 76.62,59.31 83.35,62.23 79.54,58.42 84.62,73.66 2.71,16.38 2.71,18.92 35.73,32.89 35.73,30.35 39.54,30.35 35.73,36.2 39.54,35.43 47.16,36.32 47.16,32.89 47.16,27.81 47.16,25.27 59.86,35.43 59.86,32.89 59.86,30.35 59.86,27.81 59.86,25.27 67.48,37.97 68.75,32.13 67.48,27.81 67.48,22.73 59.86,22.73 59.86,20.19 59.86,17.65 67.48,20.19 67.48,17.65 64.94,17.65 62.4,17.65 59.86,37.97 59.86,40.51 54.78,32.89 54.78,30.35 54.78,27.81 54.78,25.27 54.78,35.43 54.78,37.97 72.56,41.78 73.83,41.78 82.72,41.78 80.18,41.78 76.37,41.78 146.85,92.73 144.31,92.73 140.5,92.73 136.69,92.73 95.42,56.9 95.67,61.34 95.8,59.18 99.61,56.01 102.91,56.52 105.45,55.88 105.83,61.59 103.8,62.36 103.8,68.45 101,68.45 98.59,68.45 93.51,68.45 90.97,68.45 113.83,68.45 116.5,68.45 113.7,56.77 116.12,60.96 119.42,60.45 127.17,61.21 126.91,68.45 129.07,68.45 131.61,68.45 130.34,61.34 131.48,58.67 146.72,73.91 144.18,71.37 147.96,77.25 152.28,79.92 147.83,78.65 148.46,86.36 147.95,90.04 145.54,82.93 145.54,79.5 153.33,72.79 160.31,76.73 160.44,75.46 111.8,71.75 115.74,71.75 121.96,71.5 133.26,71.88 93,51.58 93.51,48.41 90.97,48.41 89.57,51.71 88.43,63.27 101.38,65.55 100.62,64.66 100.62,63.39 103.92,66.06 108.75,65.81 118.91,63.27 124.62,63.27 127.04,63.39 3.98,39.24 3.98,35.43 26.84,39.24 26.84,35.43 26.84,30.35 26.84,25.27 26.84,20.19 35.73,26.54 72.17,50.16 71.54,51.69 73.57,51.69 76.11,55.88 70.9,59.31 67.48,56.13 62.78,55.24 77,51.56 67.73,51.56 53.38,51.56 60.62,51.56 53.38,46.1 51.09,51.69 48.81,51.69 48.81,54.23 38.65,51.69 39.92,54.23 41.19,59.31 45,55.5 37.38,56.77 19.6,56.77 25.95,59.31 15.79,51.69 15.79,46.61 20.87,46.61 22.14,50.42 34.84,50.42 20.87,32.64 14.52,32.64 14.52,27.56 14.52,38.99 98.72,71.12 101,71.25 103.67,71.25 106.21,71.25 102.91,76.45 100.37,73.91 111.93,76.96 121.58,76.96 111.42,48.51 108.75,45.09 115.1,44.96 117.89,44.96 123.99,45.59 122.97,49.02 129.07,48.39 129.07,45.59 33.69,37.72 66.59,33.02 50.58,34.92 51.09,38.23 47.41,38.23 50.46,32.64 46.9,30.1 48.68,30.35 52.49,29.84 50.2,27.81
  pour Top (isolate 0.45, rank 2): 2.12,15 2.12,99.1 164.43,99.1 164.43,40.86 70.65,40.86 70.65,15
  pour Bottom (isolate 0.45, rank 2): 2.12,15 2.12,99.1 164.43,99.1 164.43,40.86 70.65,40.86 70.65,15
  pour Route2 (isolate 0.254, rank 2): 2.12,12 2.12,99.1 164.43,99.1 164.43,40.86 72.65,40.86 72.65,12
ECU_PWR
  Top 1.27: J7.3 J7.A3 | J7.A4 J7.4
  pour Top (isolate 0.305): 154.33,78.08 154.33,97.19 160.12,97.19 160.12,78.08
  pour Bottom (isolate 0.254): 154.33,40.86 154.33,97.19 160.12,97.19 160.12,40.86
  pour Top (isolate 0.254): 153.06,40.86 153.06,43.85 161.39,43.85 161.39,40.86
  pour Bottom (isolate 0.254): 153.06,40.86 153.06,43.85 161.39,43.85 161.39,40.86
  pour Top (isolate 0.45): 160.12,93.84 72.12,93.84 72.12,99.1 160.12,99.1
I1
  Top 0.508: 96.05,87.63 R22.2 | R21.2 95.06,86.64 96.05,87.63 | C31.1 96.91,86.77 96.05,87.63 | 96.05,87.63 J7.A5 J7.5
I2
  Top 0.508: 101.13,87.63 R25.2 | C33.1 100.52,87.02 101.13,87.63 | R24.2 102.12,86.64 101.13,87.63 | 101.13,87.63 J8.A1 J8.1
I3
  Top 0.508: 106.21,87.63 R40.2 | R39.2 105.22,86.64 106.21,87.63 | C39.1 106.82,87.02 106.21,87.63 | 106.21,87.63 J8.A2 J8.2
I4
  Top 0.508: 111.29,87.63 R43.2 | C41.1 110.68,87.02 111.29,87.63 | R42.2 112.28,86.64 111.29,87.63 | 111.29,87.63 J8.A3 J8.3
I5
  Top 0.508: 116.37,87.63 R52.2 | R51.2 115.38,86.64 116.37,87.63 | C47.1 116.98,87.02 116.37,87.63 | 116.37,87.63 J8.A4 J8.4
I6
  Top 0.508: 121.45,87.63 121.45,81.81 R55.2 | C49.1 120.84,87.02 121.45,87.63 | R54.2 122.44,86.64 121.45,87.63 | 121.45,87.63 J8.A5 J8.5
I7
  Top 0.508: 126.53,87.63 J8.A6 J8.6 | 126.53,87.63 R30.2 | R28.2 125.54,86.64 126.53,87.63 | C25.1 127.14,87.02 126.53,87.63
I8
  Top 0.508: 131.61,87.63 J8.A7 J8.7 | 131.61,87.63 R29.2 | C24.1 131,87.02 131.61,87.63 | R27.2 132.6,86.64 131.61,87.63
INT0
  Top 0.25: ESP32-J3.16 94.78,51.56 93.64,52.7 21.37,52.7 17.82,49.15 17.82,37.72 15.36,35.26 W1-J2.5
INT1  (via drill 0.35)
  Top 0.25: ESP32-J3.15 97.32,52.32 96.06,53.58 51.23,53.58 v50.46,54.36
  Bottom 0.25: W2-J2.5 49.01,35.26 50.08,36.32 50.08,53.98 v50.46,54.36
MISO  (via drill 0.35)
  Top 0.25: W1-J1.4 34.84,31.39 40.23,31.39 40.34,31.5 45.31,31.5 45.42,31.39 66.41,31.39 W2-J1.4 | ESP32-J1.20 84.62,57.91 84.11,57.4 76.11,57.4 v75.09,58.42
  Bottom 0.25: W2-J1.4 67.62,32.68 69.5,34.56 69.5,52.44 75.09,58.04 v75.09,58.42
MOSI
  Top 0.25: W1-J1.3 29.76,28.86 39.02,28.86 39.13,28.96 41.9,28.96 41.91,28.95 42.53,28.95 42.54,28.96 44.1,28.96 44.21,28.86 61.33,28.86 W2-J1.3
  Bottom 0.25: ESP32-J1.17 92.24,58.42 89.81,55.99 79.63,55.99 70,46.35 70,30.68 68.17,28.86 67.07,28.86 67.01,28.92 63.82,28.92 W2-J1.3
N$1
  pour Top (isolate 0.254, no thermals): 118.91,19.32 121.7,19.32 121.7,16.28 118.91,16.28
N$2
  Top 0.254: R2.2 U3.2
N$3
  pour Top (isolate 0.254, no thermals): 160.12,74.33 160.12,53.91 154.47,48.26 146.85,48.26 146.85,53.34 151.93,53.34 154.33,55.74 154.33,74.33
N$4
  Top 0.254: R4.2 U3.6
N$5
  Top 0.254: R5.2 U5.2
N$6
  pour Top (isolate 0.254): 98.59,19.32 101.38,19.32 101.38,16.28 98.59,16.28
N$8
  pour Top (isolate 0.254, no thermals): 85.64,19.32 88.43,19.32 88.43,16.28 85.64,16.28
N$9
  pour Top (isolate 0.254, no thermals): 105.96,19.32 108.75,19.32 108.75,16.28 105.96,16.28
N$10
  Top 0.254: R18.2 U2.2
N$11
  Top 0.254: R6.2 U5.6
N$12
  Top 0.254: R9.2 U6.2
N$13
  Top 0.254: R11.2 U6.6
N$14
  Top 0.254: R13.2 U2.6
N$15
  pour Top (isolate 0.254, no thermals): 159.55,19.32 162.34,19.32 162.34,16.28 159.55,16.28
N$17
  Top 0.406: R3.1 149.83,80.44 | 149.83,80.44 149.83,80.7 150.46,81.33 R1.1 | 149.83,80.44 C15.1
N$18
  pour Top (isolate 0.254, no thermals): 126.28,19.32 129.07,19.32 129.07,16.28 126.28,16.28
N$19
  pour Top (isolate 0.254, no thermals): 146.6,19.32 149.39,19.32 149.39,16.28 146.6,16.28
PWR  (via drill 0.3)
  other vias: 93.51,28.73 93.51,29.73 93.51,30.73 93.51,27.73 94.51,27.73 95.51,27.73 92.51,27.73 91.51,27.73 91.51,28.73 91.51,29.73 91.51,30.73 92.51,30.73 92.51,29.73 92.51,28.73 94.51,28.73 94.51,29.73 94.51,30.73 95.51,30.73 95.51,29.73 95.51,28.73 113.83,29.73 113.83,30.73 113.83,28.73 113.83,27.73 114.83,27.73 114.83,28.73 114.83,29.73 114.83,30.73 115.83,30.73 115.83,29.73 115.83,28.73 115.83,27.73 112.83,27.73 112.83,28.73 112.83,29.73 112.83,30.73 111.83,30.73 111.83,29.73 111.83,28.73 111.83,27.73 99.13,23.38 100.4,23.38 101.67,23.38 102.94,23.38 104.21,23.38 105.48,23.38 106.75,23.38 108.02,23.38 87.7,23.38 86.43,23.38 85.16,23.38 83.89,23.38 82.62,23.38 80.08,23.38 80.08,24.65 80.08,25.92 82.62,38.62 82.62,37.35 82.62,36.08 104.21,37.1 120.91,37.08 120.91,35.81 120.91,34.54 120.91,33.27 106.94,39.62 108.21,39.62 108.21,38.35 106.94,38.35 95.76,38.35 95.76,39.62 134.15,28.73 134.15,29.73 134.15,30.73 134.15,27.73 135.15,27.73 136.15,27.73 133.15,27.73 132.15,27.73 132.15,28.73 132.15,29.73 132.15,30.73 133.15,30.73 133.15,29.73 133.15,28.73 135.15,28.73 135.15,29.73 135.15,30.73 136.15,30.73 136.15,29.73 136.15,28.73 154.47,29.73 154.47,30.73 154.47,28.73 154.47,27.73 155.47,27.73 155.47,28.73 155.47,29.73 155.47,30.73 156.47,30.73 156.47,29.73 156.47,28.73 156.47,27.73 153.47,27.73 153.47,28.73 153.47,29.73 153.47,30.73 152.47,30.73 152.47,29.73 152.47,28.73 152.47,27.73 139.77,23.38 141.04,23.38 142.31,23.38 143.58,23.38 144.85,23.38 146.12,23.38 147.39,23.38 148.66,23.38 128.34,23.38 127.07,23.38 125.8,23.38 124.53,23.38 123.26,23.38 120.72,23.38 120.72,24.65 120.72,25.92 123.26,38.62 123.26,37.35 123.26,36.08 144.85,37.1 161.55,37.08 161.55,35.81 161.55,34.54 161.55,33.27 147.58,39.62 148.85,39.62 148.85,38.35 147.58,38.35 136.4,38.35 136.4,39.62
  pour Top (isolate 0.254, rank 3): 78.47,20.34 78.47,40.14 164.43,40.14 164.43,20.34
  pour Top (isolate 0.254, rank 3): 78.52,2.54 78.52,23.26 83.15,23.26 83.15,2.54
  pour Bottom (isolate 0.254, rank 3): 78.47,20.34 78.47,40.14 164.43,40.14 164.43,20.34
  pour Bottom (isolate 0.254, rank 2): 78.47,2.54 78.47,23.26 83.15,23.26 83.15,2.54
PWR_GND  (via drill 0.35)
  other vias: 75.73,16.53 74.46,16.53 74.46,17.8 75.73,19.07 74.46,20.34 75.73,21.61 77,21.61 75.73,20.34 75.73,22.88 77,24.15 75.73,25.42 77,26.69 75.73,27.96 77,29.23 75.73,30.5 77,31.77 75.73,33.04 77,34.31 75.73,35.58 77,36.85 75.73,38.12 77,39.39 75.73,39.39 84.62,12.72 85.89,12.72 87.16,12.72 99.86,12.72 101.13,12.72 102.4,12.72 104.94,12.72 106.21,12.72 107.48,12.72 120.18,12.72 121.45,12.72 122.72,12.72 125.26,12.72 126.53,12.72 127.8,12.72 140.5,12.72 141.77,12.72 143.04,12.72 145.58,12.72 146.85,12.72 148.12,12.72 160.82,12.72 162.09,12.72 163.36,12.72 99.86,15.26 102.4,15.26 101.13,15.26 104.94,15.26 106.21,15.26 107.48,15.26 120.18,15.26 121.45,15.26 122.72,15.26 125.26,15.26 126.53,15.26 127.8,15.26 140.5,15.26 141.77,15.26 143.04,15.26 145.58,15.26 146.85,15.26 148.12,15.26 160.82,15.26 162.09,15.26 163.36,15.26 163.36,13.99 162.09,13.99 160.82,13.99 148.12,13.99 146.85,13.99 145.58,13.99 143.04,13.99 141.77,13.99 140.5,13.99 127.8,13.99 126.53,13.99 125.26,13.99 122.72,13.99 121.45,13.99 120.18,13.99 107.48,13.99 106.21,13.99 104.94,13.99 102.4,13.99 101.13,13.99 99.86,13.99 87.16,15.26 85.89,15.26 84.62,15.26 84.62,13.99 85.89,13.99 87.16,13.99 74.46,13.99 74.46,12.72 75.73,12.72 77,12.72 77,13.99 77,15.26 75.73,15.26 74.46,15.26 75.73,13.99 3.34,12.72 5.88,12.72 8.42,12.72 10.96,12.72 13.5,12.72 16.04,12.72 3.34,11.45 5.88,11.45 8.42,11.45 10.96,11.45 13.5,11.45 16.04,11.45 70.65,12.72 66.84,12.72 64.3,12.72 61.76,12.72 59.22,12.72 56.68,12.72 54.14,12.72
  pour Top (isolate 0.254, rank 2): 83.6,2.54 83.6,22.25 88.05,22.25 88.05,2.54
  pour Top (isolate 0.254, rank 2): 98.97,22.25 108.37,22.25 108.37,2.54 98.97,2.54
  pour Top (isolate 0.254, rank 2): 119.29,22.25 123.79,22.25 123.79,2.54 119.29,2.54
  pour Top (isolate 0.45, rank 2): 78.07,2.54 2.12,2.54 2.12,14 71.65,14 71.65,40.14 78.07,40.14
  pour Route2 (isolate 0.254, rank 4): 73.39,3.83 73.39,40.46 164.43,40.46 164.43,3.83
  pour Route15 (isolate 0.254, rank 4): 73.39,3.83 73.39,40.46 164.43,40.46 164.43,3.83
  pour Bottom (isolate 0.45, rank 4): 164.43,2.54 2.12,2.54 2.12,14 71.65,14 71.65,40.14 164.43,40.14
  pour Top (isolate 0.254, rank 2): 124.19,2.54 124.19,22.25 128.69,22.25 128.69,2.54
  pour Top (isolate 0.254, rank 2): 139.61,22.25 144.11,22.25 144.11,2.54 139.61,2.54
  pour Top (isolate 0.254, rank 2): 144.51,22.25 149.01,22.25 149.01,2.54 144.51,2.54
  pour Top (isolate 0.254, rank 2): 159.93,22.25 164.43,22.25 164.43,2.54 159.93,2.54
Q1
  pour Top (isolate 0.254, rank 2): 88.76,2.54 88.76,24.91 90.77,26.92 93.13,26.92 93.13,2.54
Q1C  (via drill 0.35)
  Top 0.254: v93.48,40.66 93.48,37.34 R13.1
  Bottom 0.254: v93.48,40.66 93.48,43.18 89.7,46.96 ESP32-J3.18
Q2
  pour Top (isolate 0.254, rank 2): 93.89,26.92 96.05,26.92 98.26,24.71 98.26,2.54 93.89,2.54
Q2C
  Top 0.25: R15.2 94.81,43.76 94.81,44.45
  Top 0.254: R18.1 94.81,44.45 94.78,44.45 ESP32-J3.17
Q3
  pour Top (isolate 0.254, rank 2): 109.08,2.56 109.08,24.91 111.09,26.92 113.45,26.92 113.45,2.56
Q3C
  Top 0.25: R14.2 110.02,42.52 110.02,44.45
  Top 0.254: R4.1 111.43,36.07 110.02,37.48 110.02,44.45 ESP32-J3.9
Q4
  pour Top (isolate 0.254, rank 2): 114.21,26.92 116.78,26.92 118.58,25.12 118.58,2.54 114.21,2.54
Q4C  (via drill 0.35)
  Top 0.254: R2.1 115.13,36.47 114.39,37.2 112.46,37.2 111.29,38.37 v111.29,40.66
  Bottom 0.254: v111.29,40.66 111.29,43.2 115.08,46.99 ESP32-J3.8
Q5
  pour Top (isolate 0.254, rank 2): 129.4,2.54 129.4,24.91 131.41,26.92 133.77,26.92 133.77,2.54
Q5C  (via drill 0.35)
  Top 0.254: v134.12,40.66 134.12,37.34 R6.1
  Bottom 0.254: v134.12,40.66 134.12,41.94 132.86,43.2 121.45,43.2 117.66,46.99 ESP32-J3.7
Q6
  pour Top (isolate 0.254, rank 2): 134.53,26.92 136.69,26.92 138.9,24.71 138.9,2.54 134.53,2.54
Q6C  (via drill 0.35)
  Top 0.254: R5.1 v135.45,40.66
  Bottom 0.254: v135.45,40.66 135.45,43.15 134.13,44.47 122.7,44.47 ESP32-J3.6
Q7
  pour Top (isolate 0.254, rank 2): 149.72,2.54 149.72,24.91 151.73,26.92 154.09,26.92 154.09,2.54
Q7C  (via drill 0.35)
  Top 0.254: R11.1 152.07,36.07 150.66,37.48 v150.66,40.66
  Bottom 0.254: v150.66,40.66 150.66,41.91 143.04,49.53 127.8,49.53 ESP32-J3.4
Q8
  pour Top (isolate 0.254, rank 2): 154.85,26.92 157.42,26.92 159.22,25.12 159.22,2.54 154.85,2.54
Q8C  (via drill 0.35)
  Top 0.254: R9.1 155.15,36.07 154.01,37.2 152.84,37.2 151.93,38.12 v151.93,40.66
  Bottom 0.254: v151.93,40.66 151.93,43.2 144.33,50.8 126.53,50.8 ESP32-J3.5
RST0  (via drill 0.35)
  Top 0.25: ESP32-J1.9 112.56,56.52 110.62,54.58 65.22,54.58 v61.76,58.04
  Bottom 0.25: W1-J2.3 17.65,30.18 18.71,31.24 18.71,52.7 24.04,58.04 v61.76,58.04
RST1  (via drill 0.35)
  Top 0.25: ESP32-J3.10 110.02,52.07 108.01,54.08 54.29,54.08 v53.76,54.61
  Bottom 0.25: W2-J2.3 46.03,28.91 48.89,28.91 52.24,32.26 52.24,53.59 53.25,54.61 v53.76,54.61
SCLK  (via drill 0.35)
  Top 0.25: W2-J1.5 61.33,33.94 44.21,33.94 44.1,34.05 42.54,34.05 42.53,34.03 41.91,34.03 41.9,34.05 39.13,34.05 39.02,33.94 31.4,33.94 31.39,33.95 29.77,33.95 W1-J1.5 | ESP32-J1.16 94.78,57.59 93.87,56.68 72.08,56.68 v71.29,55.89 v71.29,55.88
  Bottom 0.25: W2-J1.5 63.8,33.98 67.03,33.98 67.07,33.94 68.17,33.94 69,34.77 69,54.1 70.78,55.88 v71.29,55.88

## Text on the board
tPlace: Breite: 101,8 mm, Länge: 96,3 mm | nutzbare Breite: 99 mm, Länge: 95 mm
tNames: M | M | + | + | I1 | I2 | I3 | I4 | I5 | I6 | I7 | I8 | L | H | + | M | M | M | + | + | L | H | P | M | +5V | ETH 1 | ETH 2 | ECU_GND | ECU_PWR | PWR | PWR | PWR_GND | PWR_GND | M | + | M | Q1 | Q2 | M | M | Q3 | Q4 | M | M | Q5 | Q6 | M | M | Q7 | Q8 | M
bNames: ECU_GND | ECU_PWR | PWR_GND | PWR | PWR_GND | PWR